# Altium schematic sheet Docking_Connection.SchDoc
size B; SheetNumber: 3; SheetTotal: 11
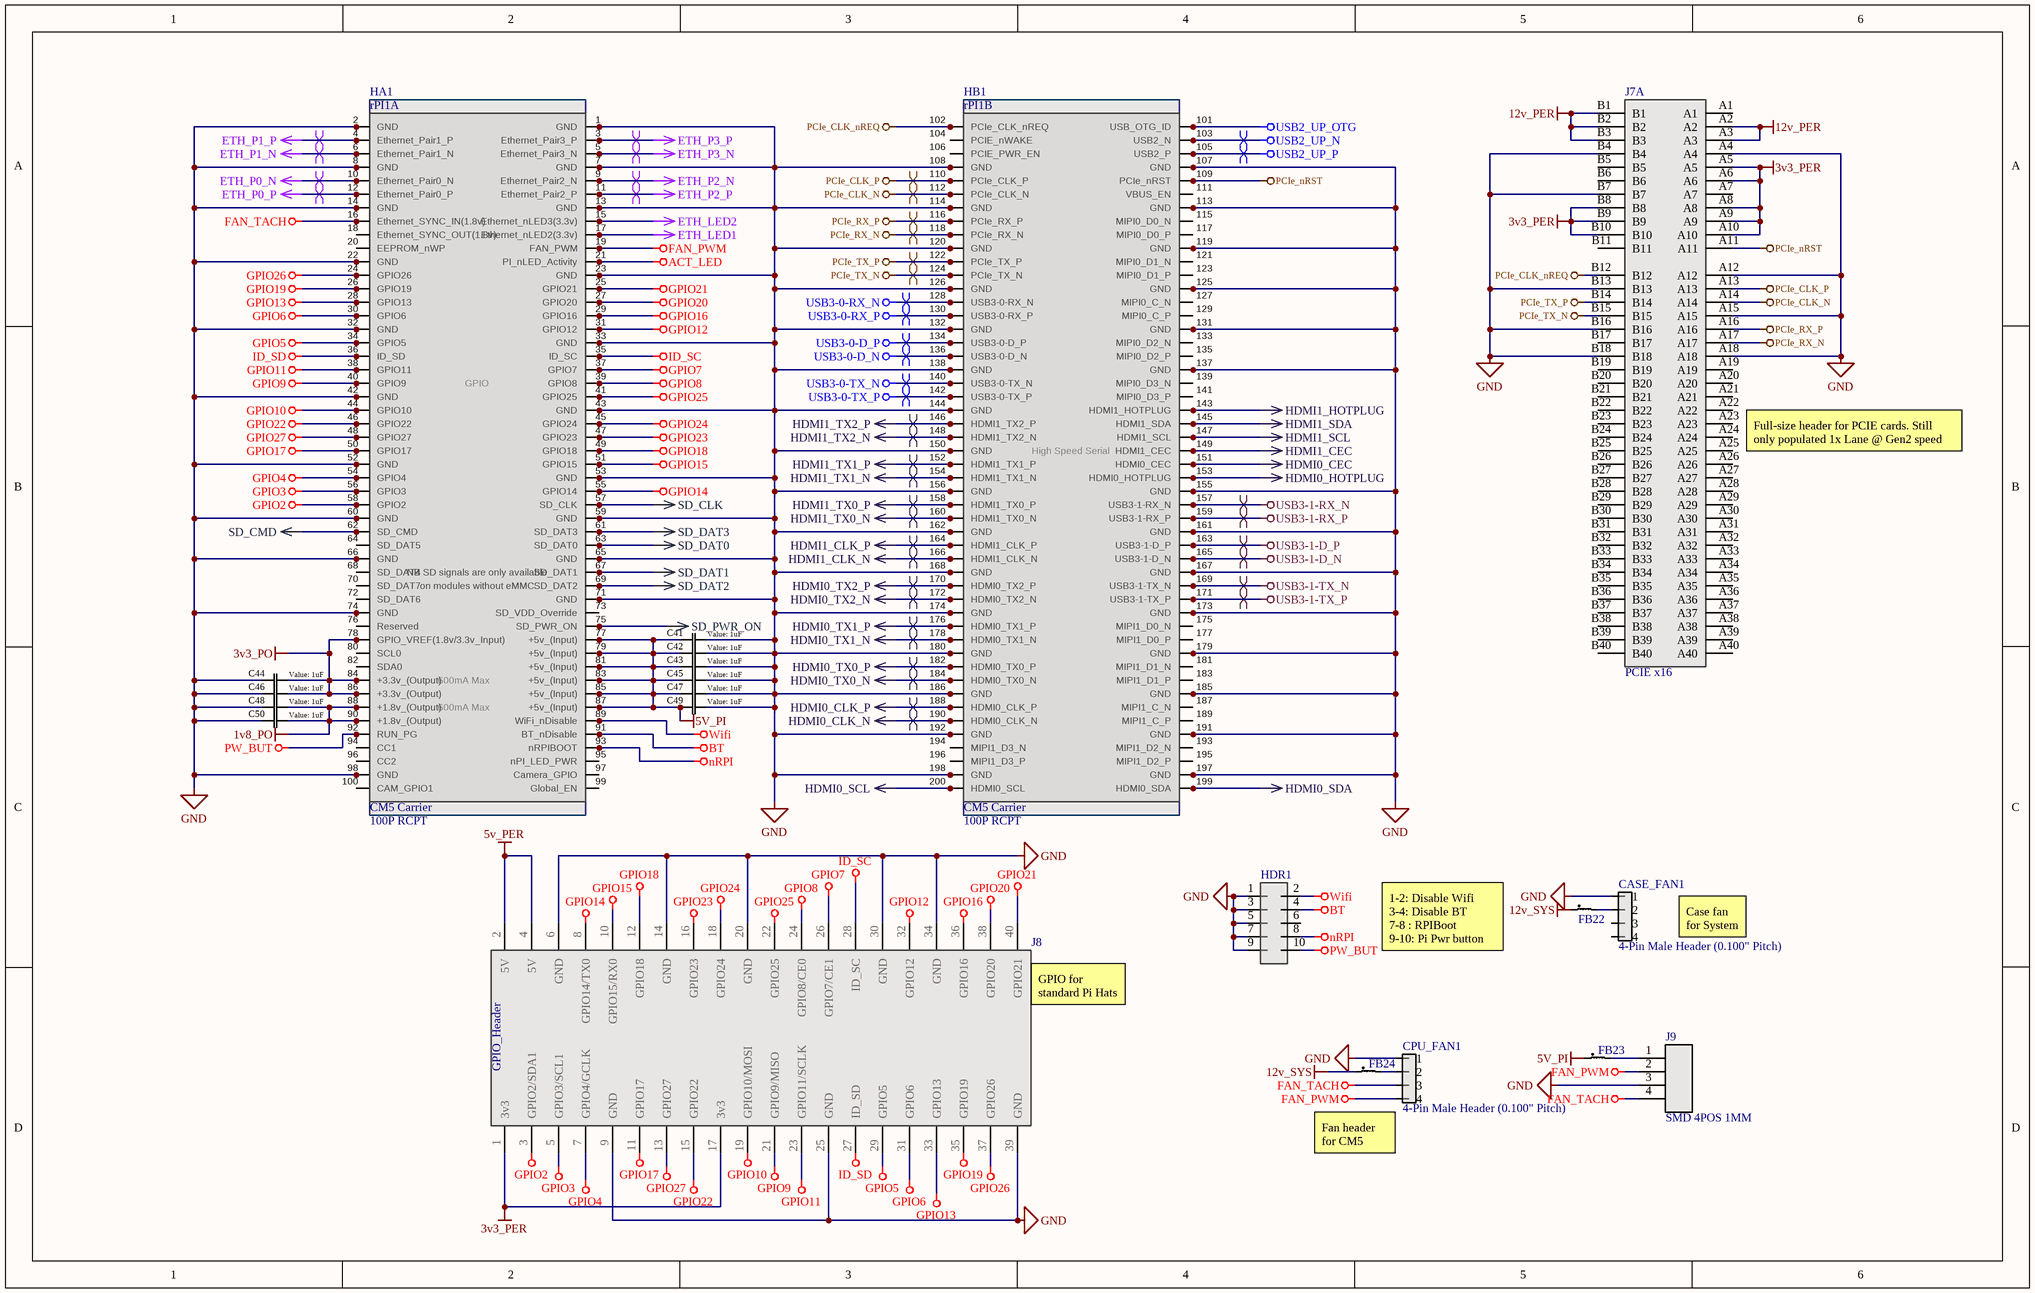
[diagram p0: Docking_Connection.SchDoc]

## Parts
C41  value 1uF  [0603]  (hidden comment: Generic Capacitor)
C42  value 1uF  [0603]  (hidden comment: Generic Capacitor)
C43  value 1uF  [0603]  (hidden comment: Generic Capacitor)
C44  value 1uF  [0603]  (hidden comment: Generic Capacitor)
C45  value 1uF  [0603]  (hidden comment: Generic Capacitor)
C46  value 1uF  [0603]  (hidden comment: Generic Capacitor)
C47  value 1uF  [0603]  (hidden comment: Generic Capacitor)
C48  value 1uF  [0603]  (hidden comment: Generic Capacitor)
C49  value 1uF  [0603]  (hidden comment: Generic Capacitor)
C50  value 1uF  [0603]  (hidden comment: Generic Capacitor)
CASE_FAN1  4-Pin Male Header (0.100" Pitch)  [TSW-104-07-T-S]
CPU_FAN1  4-Pin Male Header (0.100" Pitch)  [TSW-104-07-T-S]
FB22  0603 Ferrite  [0603]  (value not drawn)
FB23  0603 Ferrite  [0603]  (value not drawn)
FB24  0603 Ferrite  [0603]  (value not drawn)
HA1  100P RCPT  [DF40HC(3.0)-100DS-0.4V(51)]
HB1  100P RCPT  [DF40HC(3.0)-100DS-0.4V(51)]
HDR1  10pinMobo  [10pinMobo]  (value not drawn)
J7  PCIE x16  [10018783-10203TLF]  (part A of 2)
J8  rPi Zero Carrier  [rPiHeader]  (value not drawn)
J9  SMD 4POS 1MM  [CONN4_BM04B-SRSS_JST]
rPI1  CM5 Carrier  [CM4-FTPD]  (parts A,B of 2)

## Nets
1v8_PO: C48.1 C50.1 HA1.88 HA1.90 rPI1.88(+1.8v_(Output)) rPI1.90(+1.8v_(Output))
3v3_PER: J7.A5 J7.A6 J7.A8 J7.A9 J7.A10 J7.B8 J7.B9 J7.B10 J8.1(3v3) J8.17(3v3)
3v3_PO: C44.1 C46.1 HA1.78 HA1.84 HA1.86 rPI1.78(GPIO_VREF(1.8v/3.3v_Input)) rPI1.84(+3.3v_(Output)) rPI1.86(+3.3v_(Output))
5v_PER: J8.2(5V) J8.4(5V)
5V_PI: C41.2 C42.2 C43.2 C45.2 C47.2 C49.2 FB23.1 HA1.77 HA1.79 HA1.81 HA1.83 HA1.85 HA1.87 rPI1.77(+5v_(Input)) rPI1.79(+5v_(Input)) rPI1.81(+5v_(Input)) rPI1.83(+5v_(Input)) rPI1.85(+5v_(Input)) rPI1.87(+5v_(Input))
12v_PER: J7.A2 J7.A3 J7.B1 J7.B2 J7.B3
12v_SYS: FB22.1 FB24.1
ACT_LED: HA1.21 rPI1.21(PI_nLED_Activity)
BT: HA1.91 HDR1.4 rPI1.91(BT_nDisable)
ETH_LED1: HA1.17 rPI1.17(Ethernet_nLED2(3.3v))
ETH_LED2: HA1.15 rPI1.15(Ethernet_nLED3(3.3v))
ETH_P0_N: HA1.10 rPI1.10(Ethernet_Pair0_N)
ETH_P0_P: HA1.12 rPI1.12(Ethernet_Pair0_P)
ETH_P1_N: HA1.6 rPI1.6(Ethernet_Pair1_N)
ETH_P1_P: HA1.4 rPI1.4(Ethernet_Pair1_P)
ETH_P2_N: HA1.9 rPI1.9(Ethernet_Pair2_N)
ETH_P2_P: HA1.11 rPI1.11(Ethernet_Pair2_P)
ETH_P3_N: HA1.5 rPI1.5(Ethernet_Pair3_N)
ETH_P3_P: HA1.3 rPI1.3(Ethernet_Pair3_P)
FAN_PWM: CPU_FAN1.4 HA1.19 J9.2 rPI1.19(FAN_PWM)
FAN_TACH: CPU_FAN1.3 HA1.16 J9.4 rPI1.16(Ethernet_SYNC_IN(1.8v))
GND: C41.1 C42.1 C43.1 C44.2 C45.1 C46.2 C47.1 C48.2 C49.1 C50.2 CASE_FAN1.1 CPU_FAN1.1 HA1.1 HA1.2 HA1.7 HA1.8 HA1.13 HA1.14 HA1.22 HA1.23 HA1.32 HA1.33 HA1.42 HA1.43 HA1.52 HA1.53 HA1.59 HA1.60 HA1.65 HA1.66 HA1.71 HA1.74 HA1.98 HB1.7 HB1.8 HB1.13 HB1.14 HB1.19 HB1.20 HB1.25 HB1.26 HB1.31 HB1.32 HB1.37 HB1.38 HB1.44 HB1.50 HB1.55 HB1.56 HB1.61 HB1.62 HB1.67 HB1.68 HB1.73 HB1.74 HB1.79 HB1.80 HB1.85 HB1.86 HB1.91 HB1.92 HB1.97 HB1.98 HDR1.1 HDR1.3 HDR1.5 HDR1.7 HDR1.9 J7.A4 J7.A12 J7.A15 J7.A18 J7.B4 J7.B7 J7.B13 J7.B16 J7.B18 J8.6(GND) J8.9(GND) J8.14(GND) J8.20(GND) J8.25(GND) J8.30(GND) J8.34(GND) J8.39(GND) J9.3 rPI1.1(GND) rPI1.2(GND) rPI1.7(GND) rPI1.8(GND) rPI1.13(GND) rPI1.14(GND) rPI1.22(GND) rPI1.23(GND) rPI1.32(GND) rPI1.33(GND) rPI1.42(GND) rPI1.43(GND) rPI1.52(GND) rPI1.53(GND) rPI1.59(GND) rPI1.60(GND) rPI1.65(GND) rPI1.66(GND) rPI1.71(GND) rPI1.74(GND) rPI1.98(GND) rPI1.107(GND) rPI1.108(GND) rPI1.113(GND) rPI1.114(GND) rPI1.119(GND) rPI1.120(GND) rPI1.125(GND) rPI1.126(GND) rPI1.131(GND) rPI1.132(GND) rPI1.137(GND) rPI1.138(GND) rPI1.144(GND) rPI1.150(GND) rPI1.155(GND) rPI1.156(GND) rPI1.161(GND) rPI1.162(GND) rPI1.167(GND) rPI1.168(GND) rPI1.173(GND) rPI1.174(GND) rPI1.179(GND) rPI1.180(GND) rPI1.185(GND) rPI1.186(GND) rPI1.191(GND) rPI1.192(GND) rPI1.197(GND) rPI1.198(GND)
GPIO2: HA1.58 J8.3(GPIO2/SDA1) rPI1.58(GPIO2)
GPIO3: HA1.56 J8.5(GPIO3/SCL1) rPI1.56(GPIO3)
GPIO4: HA1.54 J8.7(GPIO4/GCLK) rPI1.54(GPIO4)
GPIO5: HA1.34 J8.29(GPIO5) rPI1.34(GPIO5)
GPIO6: HA1.30 J8.31(GPIO6) rPI1.30(GPIO6)
GPIO7: HA1.37 J8.26(GPIO7/CE1) rPI1.37(GPIO7)
GPIO8: HA1.39 J8.24(GPIO8/CE0) rPI1.39(GPIO8)
GPIO9: HA1.40 J8.21(GPIO9/MISO) rPI1.40(GPIO9)
GPIO10: HA1.44 J8.19(GPIO10/MOSI) rPI1.44(GPIO10)
GPIO11: HA1.38 J8.23(GPIO11/SCLK) rPI1.38(GPIO11)
GPIO12: HA1.31 J8.32(GPIO12) rPI1.31(GPIO12)
GPIO13: HA1.28 J8.33(GPIO13) rPI1.28(GPIO13)
GPIO14: HA1.55 J8.8(GPIO14/TX0) rPI1.55(GPIO14)
GPIO15: HA1.51 J8.10(GPIO15/RX0) rPI1.51(GPIO15)
GPIO16: HA1.29 J8.36(GPIO16) rPI1.29(GPIO16)
GPIO17: HA1.50 J8.11(GPIO17) rPI1.50(GPIO17)
GPIO18: HA1.49 J8.12(GPIO18) rPI1.49(GPIO18)
GPIO19: HA1.26 J8.35(GPIO19) rPI1.26(GPIO19)
GPIO20: HA1.27 J8.38(GPIO20) rPI1.27(GPIO20)
GPIO21: HA1.25 J8.40(GPIO21) rPI1.25(GPIO21)
GPIO22: HA1.46 J8.15(GPIO22) rPI1.46(GPIO22)
GPIO23: HA1.47 J8.16(GPIO23) rPI1.47(GPIO23)
GPIO24: HA1.45 J8.18(GPIO24) rPI1.45(GPIO24)
GPIO25: HA1.41 J8.22(GPIO25) rPI1.41(GPIO25)
GPIO26: HA1.24 J8.37(GPIO26) rPI1.24(GPIO26)
GPIO27: HA1.48 J8.13(GPIO27) rPI1.48(GPIO27)
HDMI0_CEC: HB1.51 rPI1.151(HDMI0_CEC)
HDMI0_CLK_N: HB1.90 rPI1.190(HDMI0_CLK_N)
HDMI0_CLK_P: HB1.88 rPI1.188(HDMI0_CLK_P)
HDMI0_HOTPLUG: HB1.53 rPI1.153(HDMI0_HOTPLUG)
HDMI0_SCL: HB1.100 rPI1.200(HDMI0_SCL)
HDMI0_SDA: HB1.99 rPI1.199(HDMI0_SDA)
HDMI0_TX0_N: HB1.84 rPI1.184(HDMI0_TX0_N)
HDMI0_TX0_P: HB1.82 rPI1.182(HDMI0_TX0_P)
HDMI0_TX1_N: HB1.78 rPI1.178(HDMI0_TX1_N)
HDMI0_TX1_P: HB1.76 rPI1.176(HDMI0_TX1_P)
HDMI0_TX2_N: HB1.72 rPI1.172(HDMI0_TX2_N)
HDMI0_TX2_P: HB1.70 rPI1.170(HDMI0_TX2_P)
HDMI1_CEC: HB1.49 rPI1.149(HDMI1_CEC)
HDMI1_CLK_N: HB1.66 rPI1.166(HDMI1_CLK_N)
HDMI1_CLK_P: HB1.64 rPI1.164(HDMI1_CLK_P)
HDMI1_HOTPLUG: HB1.43 rPI1.143(HDMI1_HOTPLUG)
HDMI1_SCL: HB1.47 rPI1.147(HDMI1_SCL)
HDMI1_SDA: HB1.45 rPI1.145(HDMI1_SDA)
HDMI1_TX0_N: HB1.60 rPI1.160(HDMI1_TX0_N)
HDMI1_TX0_P: HB1.58 rPI1.158(HDMI1_TX0_P)
HDMI1_TX1_N: HB1.54 rPI1.154(HDMI1_TX1_N)
HDMI1_TX1_P: HB1.52 rPI1.152(HDMI1_TX1_P)
HDMI1_TX2_N: HB1.48 rPI1.148(HDMI1_TX2_N)
HDMI1_TX2_P: HB1.46 rPI1.146(HDMI1_TX2_P)
ID_SC: HA1.35 J8.28(ID_SC) rPI1.35(ID_SC)
ID_SD: HA1.36 J8.27(ID_SD) rPI1.36(ID_SD)
nRPI: HA1.93 HDR1.8 rPI1.93(nRPIBOOT)
PCIe_CLK_N: HB1.12 J7.A14 rPI1.112(PCIe_CLK_N)
PCIe_CLK_nREQ: HB1.2 J7.B12 rPI1.102(PCIe_CLK_nREQ)
PCIe_CLK_P: HB1.10 J7.A13 rPI1.110(PCIe_CLK_P)
PCIe_nRST: HB1.9 J7.A11 rPI1.109(PCIe_nRST)
PCIe_RX_N: HB1.18 J7.A17 rPI1.118(PCIe_RX_N)
PCIe_RX_P: HB1.16 J7.A16 rPI1.116(PCIe_RX_P)
PCIe_TX_N: HB1.24 J7.B15 rPI1.124(PCIe_TX_N)
PCIe_TX_P: HB1.22 J7.B14 rPI1.122(PCIe_TX_P)
PW_BUT: HA1.92 HDR1.10 rPI1.92(RUN_PG)
SD_CLK: HA1.57 rPI1.57(SD_CLK)
SD_CMD: HA1.62 rPI1.62(SD_CMD)
SD_DAT0: HA1.63 rPI1.63(SD_DAT0)
SD_DAT1: HA1.67 rPI1.67(SD_DAT1)
SD_DAT2: HA1.69 rPI1.69(SD_DAT2)
SD_DAT3: HA1.61 rPI1.61(SD_DAT3)
SD_PWR_ON: HA1.75 rPI1.75(SD_PWR_ON)
USB2_UP_N: HB1.3 rPI1.103(USB2_N)
USB2_UP_OTG: HB1.1 rPI1.101(USB_OTG_ID)
USB2_UP_P: HB1.5 rPI1.105(USB2_P)
USB3-0-D_N: HB1.36 rPI1.136(USB3-0-D_N)
USB3-0-D_P: HB1.34 rPI1.134(USB3-0-D_P)
USB3-0-RX_N: HB1.28 rPI1.128(USB3-0-RX_N)
USB3-0-RX_P: HB1.30 rPI1.130(USB3-0-RX_P)
USB3-0-TX_N: HB1.40 rPI1.140(USB3-0-TX_N)
USB3-0-TX_P: HB1.42 rPI1.142(USB3-0-TX_P)
USB3-1-D_N: HB1.65 rPI1.165(USB3-1-D_N)
USB3-1-D_P: HB1.63 rPI1.163(USB3-1-D_P)
USB3-1-RX_N: HB1.57 rPI1.157(USB3-1-RX_N)
USB3-1-RX_P: HB1.59 rPI1.159(USB3-1-RX_P)
USB3-1-TX_N: HB1.69 rPI1.169(USB3-1-TX_N)
USB3-1-TX_P: HB1.71 rPI1.171(USB3-1-TX_P)
Wifi: HA1.89 HDR1.2 rPI1.89(WiFi_nDisable)
NetCASE_FAN1_2: CASE_FAN1.2 FB22.2
NetCPU_FAN1_2: CPU_FAN1.2 FB24.2
NetFB23_2: FB23.2 J9.1
NetHA1_18: HA1.18 rPI1.18(Ethernet_SYNC_OUT(1.8v))
NetHA1_20: HA1.20 rPI1.20(EEPROM_nWP)
NetHA1_64: HA1.64 rPI1.64(SD_DAT5)
NetHA1_68: HA1.68 rPI1.68(SD_DAT4)
NetHA1_70: HA1.70 rPI1.70(SD_DAT7)
NetHA1_72: HA1.72 rPI1.72(SD_DAT6)
NetHA1_73: HA1.73 rPI1.73(SD_VDD_Override)
NetHA1_76: HA1.76 rPI1.76(Reserved)
NetHA1_80: HA1.80 rPI1.80(SCL0)
NetHA1_82: HA1.82 rPI1.82(SDA0)
NetHA1_94: HA1.94 rPI1.94(CC1)
NetHA1_95: HA1.95 rPI1.95(nPI_LED_PWR)
NetHA1_96: HA1.96 rPI1.96(CC2)
NetHA1_97: HA1.97 rPI1.97(Camera_GPIO)
NetHA1_99: HA1.99 rPI1.99(Global_EN)
NetHA1_100: HA1.100 rPI1.100(CAM_GPIO1)
NetHB1_4: HB1.4 rPI1.104(PCIE_nWAKE)
NetHB1_6: HB1.6 rPI1.106(PCIE_PWR_EN)
NetHB1_11: HB1.11 rPI1.111(VBUS_EN)
NetHB1_15: HB1.15 rPI1.115(MIPI0_D0_N)
NetHB1_17: HB1.17 rPI1.117(MIPI0_D0_P)
NetHB1_21: HB1.21 rPI1.121(MIPI0_D1_N)
NetHB1_23: HB1.23 rPI1.123(MIPI0_D1_P)
NetHB1_27: HB1.27 rPI1.127(MIPI0_C_N)
NetHB1_29: HB1.29 rPI1.129(MIPI0_C_P)
NetHB1_33: HB1.33 rPI1.133(MIPI0_D2_N)
NetHB1_35: HB1.35 rPI1.135(MIPI0_D2_P)
NetHB1_39: HB1.39 rPI1.139(MIPI0_D3_N)
NetHB1_41: HB1.41 rPI1.141(MIPI0_D3_P)
NetHB1_75: HB1.75 rPI1.175(MIPI1_D0_N)
NetHB1_77: HB1.77 rPI1.177(MIPI1_D0_P)
NetHB1_81: HB1.81 rPI1.181(MIPI1_D1_N)
NetHB1_83: HB1.83 rPI1.183(MIPI1_D1_P)
NetHB1_87: HB1.87 rPI1.187(MIPI1_C_N)
NetHB1_89: HB1.89 rPI1.189(MIPI1_C_P)
NetHB1_93: HB1.93 rPI1.193(MIPI1_D2_N)
NetHB1_94: HB1.94 rPI1.194(MIPI1_D3_N)
NetHB1_95: HB1.95 rPI1.195(MIPI1_D2_P)
NetHB1_96: HB1.96 rPI1.196(MIPI1_D3_P)

Not connected (* = marked no-connect by the designer): CASE_FAN1 3 4; HDR1 6; J7 A1 A7 A19 A20 A21 A22 A23 A24 A25 A26 A27 A28 A29 A30 A31 A32 A33 A34 A35 A36 A37 A38 A39 A40 B5 B6 B11 B17 B19 B20 B21 B22 B23 B24 B25 B26 B27 B28 B29 B30 B31 B32 B33 B34 B35 B36 B37 B38 B39 B40

## Layout directives
differential pair: ETH_P0_N, ETH_P0_P, ETH_P1_N, ETH_P1_P, ETH_P2_N, ETH_P2_P, ETH_P3_N, ETH_P3_P, HDMI0_CLK_N, HDMI0_CLK_P, HDMI0_TX0_N, HDMI0_TX0_P, HDMI0_TX1_N, HDMI0_TX1_P, HDMI0_TX2_N, HDMI0_TX2_P, HDMI1_CLK_N, HDMI1_CLK_P, HDMI1_TX0_N, HDMI1_TX0_P, HDMI1_TX1_N, HDMI1_TX1_P, HDMI1_TX2_N, HDMI1_TX2_P, PCIe_CLK_N, PCIe_CLK_P, PCIe_RX_N, PCIe_RX_P, PCIe_TX_N, PCIe_TX_P, USB2_UP_N, USB2_UP_P, USB3-0-D_N, USB3-0-D_P, USB3-0-RX_N, USB3-0-RX_P, USB3-0-TX_N, USB3-0-TX_P, USB3-1-D_N, USB3-1-D_P, USB3-1-RX_N, USB3-1-RX_P, USB3-1-TX_N, USB3-1-TX_P

## Notes on the sheet
- (near J7) Full-size header for PCIE cards. Still only populated 1x Lane @ Gen2 speed
- 1-2: Disable Wifi
  3-4: Disable BT
  7-8 : RPIBoot
  9-10: Pi Pwr button
- Case fan for System
- (near J8) GPIO for standard Pi Hats
- (near CPU_FAN1) Fan header for CM5
- REV
- REVISIONS
- DATE
- DESCRIPTION
- BY
- UNLESS OTHERWISE SPECIFIED, DRAWING DEFINITIONS AND TOLERANCES SHALL BE FOUND UNDER SUPPLIER STANDARDS SS-001. THIS PART AND ALL COMPONENTS OF IT MUST BE RoHS & REACH COMPLIANT. A CERTIFICATE OF COMPLIANCE MUST BE PROVIDED UPON REQUEST.
- ALL INFORMATION ON THIS DOCUMENT IS THE SOLE PROPERTY OF GAMBER-JOHNSON AND SHALL NOT BE COPIED, REPRODUCED, USED OR DISCLOSED IN WHOLE OR IN PART WITHOUT THE WRITTEN CONSENT OF GAMBER-JOHNSON
- TOLERANCES
  .00 ± .060
  .000 ± .020
  .0000 ± .005
  ANGELS ± 1°
- DRAWN BY:
- PROJECT NUMBER:
- SHEET TITLE:
- SHEET
- OF
- DATE:
- LOCATION:
- ASSEMBLY NUMBER
- SIZE
- GAMBER-JOHNSON LLC
  5001 JOERNS DR.
  STEVENS POINT, WI 54481
  +1 (715) 344-5209
- B
- (in symbol RP-CM5, part A) GPIO; NB SD signals are only available; on modules without eMMC; 600mA Max
- (in symbol RP-CM5, part B) High Speed Serial
- (in symbol RP-Zero_1) GPIO_Header

## Library data of the parts
C41-C50 = Generic Capacitor: Voltage: 6V; Tolerance: 5%
CASE_FAN1 CPU_FAN1 = TSW-104-07-T-S: Connector Header Through Hole 4 position 0.100" (2.54mm); Manufacturer 1: Samtec; Manufacturer Part Number 1: MTSW-104-07-T-S-170; Number of Contacts: 4; Supplier 1: Avnet; RoHS: Yes; Category: Connectors; Mount: Through Hole; Contact Plating: Tin; Contact Material: Bronze; Min Operating Temperature: -55°C; Max Operating Temperature: 105°C; Number of Rows: 1; Termination: Solder; Gender: Male; Packaging: Bulk; Orientation: Vertical; Pitch: 2.54mm; Radiation Hardening: No; RoHS Compliant: Yes; Lead Free: Lead Free; ComponentLink1URL: http://www.samtec.com/documents/webfiles/pdf/HMTSW.PDF?src-supplier=Avnet; ComponentLink1Description: http://www.samtec.com/documents/webfiles/pdf/HMTSW.PDF?src-supplier=Avnet; Supplier Part Number 1: MTSW-104-07-T-S-170
FB22-FB24 = PE-0603FB121ST: 120 Ohms @ 100 MHz 1 Signal Line Ferrite Bead 0603 (1608 Metric) 500mA 180mOhm; Manufacturer: Pulse; Number of Lines: 1; DC Resistance (DCR): 180mR; Supplier 1: Digi-Key; Supplier Part Number 1: 553-2382-1-ND; Manufacturer Part Number: PE-0603FB121ST; RoHS: Yes; Category: Inductors; Stock 1: 6181; Pricing 1: 1=0.10000, 10=0.04400, 25=0.03920, 50=0.03580, 100=0.03220, 250=0.02360, 500=0.01716, 1000=0.01680 (USD); Mount: Surface Mount; Case/Package: 0603; Case Code (Metric): 1608; Case Code (Imperial): 0603; Min Operating Temperature: -40°C; Max Operating Temperature: 105°C; Package Quantity: 4000; Packaging: Tape and Reel; Max Current Rating: 500mA; Length: 0.063inch; Width: 0.031inch; Height: 0.037inch; RoHS Compliant: Yes; ComponentLink1URL: https://productfinder.pulseeng.com/doc_type/WEB301/doc_num/WC706/doc_part/WC706.pdf?src-supplier=Digi-Key; ComponentLink1Description: https://productfinder.pulseeng.com/doc_type/WEB301/doc_num/WC706/doc_part/WC706.pdf?src-supplier=Digi-Key; ComponentLink2URL: http://productfinder.pulseeng.com/products/datasheets/WC706.pdf?src-supplier=Digi-Key; ComponentLink2Description: http://productfinder.pulseeng.com/products/datasheets/WC706.pdf?src-supplier=Digi-Key; LCSC PN: C275486
HA1 HB1 = DF40-100DS RCPT_1: 100 Position Connector Receptacle, Center Strip Contacts Surface Mount Gold; MF: Hirose; MP: DF40C-100DS-0.4V(51); SnapEDA_Link: https://www.snapeda.com/parts/DF40C-100DS-0.4V(51)/Hirose/view-part/?ref=snap; Package: None; Value: *; Check_prices: https://www.snapeda.com/parts/DF40C-100DS-0.4V(51)/Hirose/view-part/?ref=eda; LCSC PN: C424649; Supplier 1: Avnet; Supplier Part Number 1: DF40C-100DS-0.4V(5; Supplier 2: Digikey; Supplier Part Number 2: 26-DF40HC(3.0)-100DS-0.4V(51)CT-ND
HDR1 = 10pinMobo: 10pin motherboard jack
J7 = 10018783-10203TLF: 164 Position Female Connector PCI Express™ Gold 0.039" (1.00mm) Black; MF: Amphenol ICC; Package: None; Price: None; Value: *; MP: 10018783-10203TLF; Availability: Unavailable; LCSC PN: C426228; Supplier 1: Avnet; Supplier Part Number 1: 73P6874
J8 = RP-Zero_1: Raspberry Pi Zero/W/2W / Header, debug-pads, & mounting
J9 = BM04B-SRSS-TB: Connector Header Surface Mount 4 position 0.039" (1.00mm); Mfr_Name: JST; Type: Headers, Male Pins; RefDes: RefDes; LCSC PN: C160390
rPI1 = RP-CM5: Compute Module 5 Footprint / Overlap Hirose 100P connector over pads to place actual components